# EAGLE design InvertingMixer (EAGLE 6.6.0)
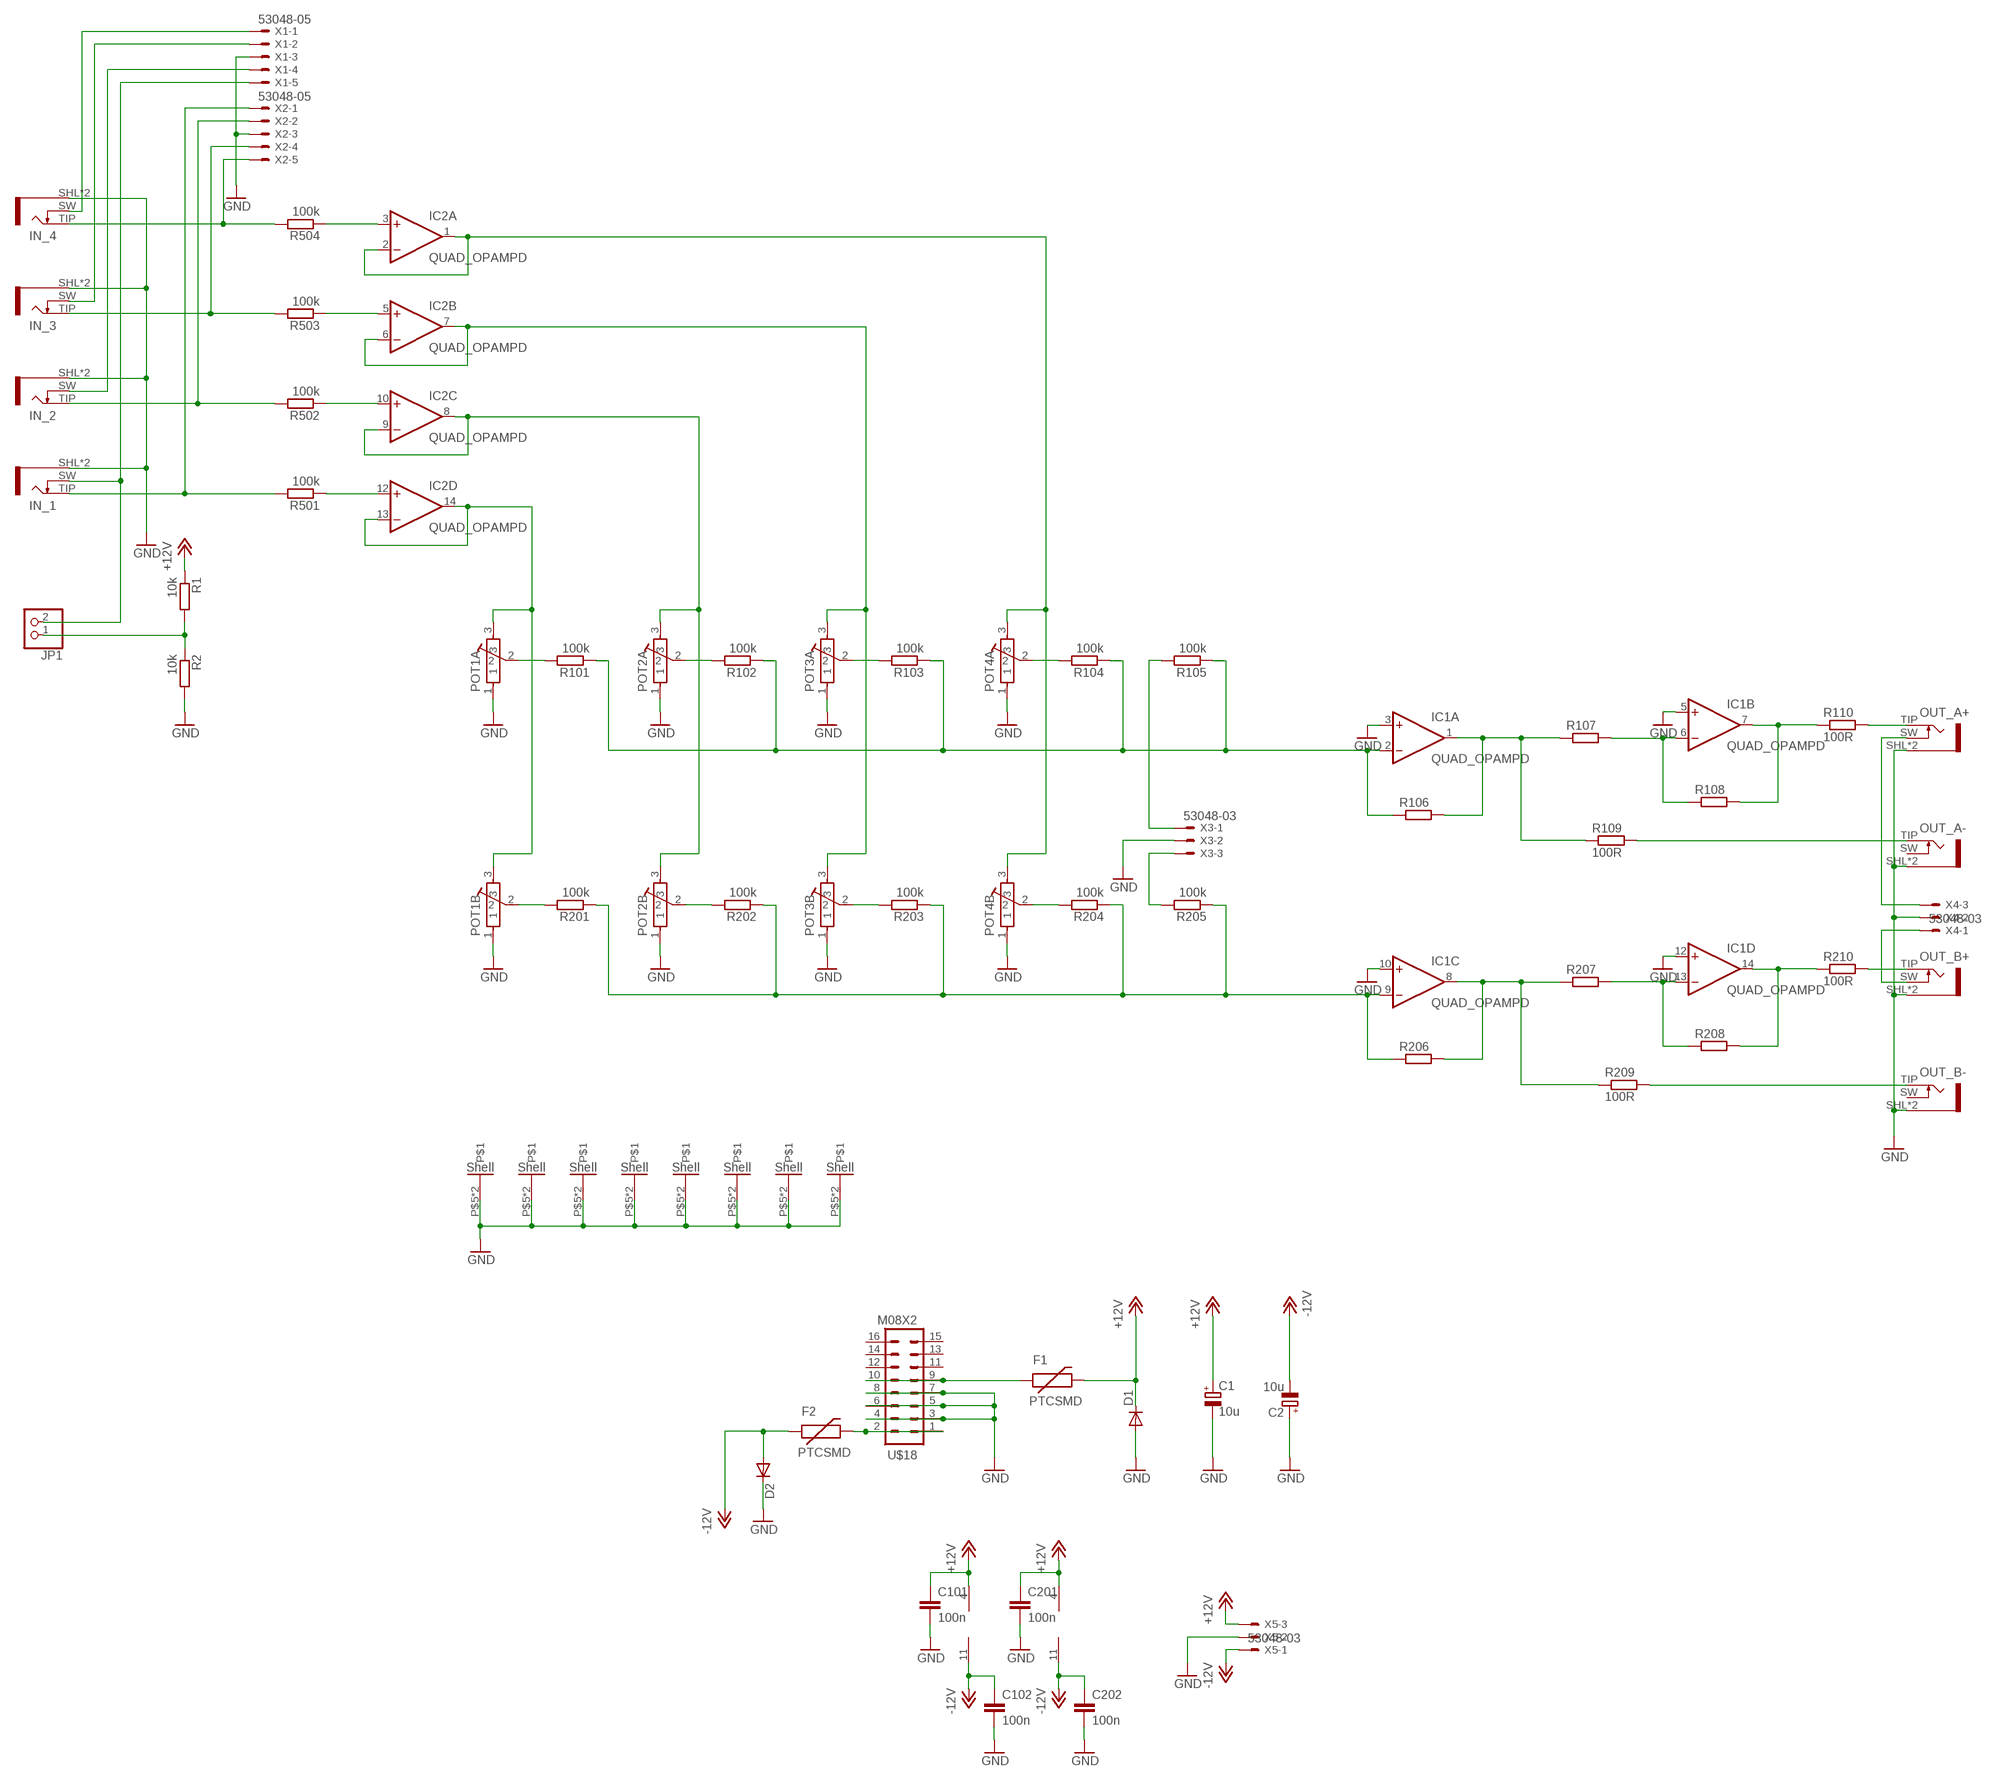
[diagram p0: schematic, sheet 1]

## Parts
C1  10u  CPOL-EUA  [PANASONIC_A]
C2  10u  CPOL-EUA  [PANASONIC_A]
C101  100n  C-EUC0603  [C0603]
C102  100n  C-EUC0603  [C0603]
C201  100n  C-EUC0603  [C0603]
C202  100n  C-EUC0603  [C0603]
D1  DIODESMA  [SMA-DIODE]
D2  DIODESMA  [SMA-DIODE]
F1  PTCSMD  [PTC-1206]
F2  PTCSMD  [PTC-1206]
IC1  QUAD_OPAMPD  [SO14]
IC2  QUAD_OPAMPD  [SO14]
IN_1  JACK-PJ-301B  [PJ-301B]
IN_2  JACK-PJ-301B  [PJ-301B]
IN_3  JACK-PJ-301B  [PJ-301B]
IN_4  JACK-PJ-301B  [PJ-301B]
JP1  PINHD-1X2  [1X02]
OUT_A+  JACK-PJ-301B  [PJ-301B]
OUT_A-  JACK-PJ-301B  [PJ-301B]
OUT_B+  JACK-PJ-301B  [PJ-301B]
OUT_B-  JACK-PJ-301B  [PJ-301B]
POT1A  POT-ALPS-RK09L1140  [POT-ALPS-RK09L1140]
POT1B  POT-ALPS-RK09L1140  [POT-ALPS-RK09L1140]
POT2A  POT-ALPS-RK09L1140  [POT-ALPS-RK09L1140]
POT2B  POT-ALPS-RK09L1140  [POT-ALPS-RK09L1140]
POT3A  POT-ALPS-RK09L1140  [POT-ALPS-RK09L1140]
POT3B  POT-ALPS-RK09L1140  [POT-ALPS-RK09L1140]
POT4A  POT-ALPS-RK09L1140  [POT-ALPS-RK09L1140]
POT4B  POT-ALPS-RK09L1140  [POT-ALPS-RK09L1140]
R1  10k  R-EU_R0603  [R0603]
R2  10k  R-EU_R0603  [R0603]
R101  100k  R-EU_R0603  [R0603]
R102  100k  R-EU_R0603  [R0603]
R103  100k  R-EU_R0603  [R0603]
R104  100k  R-EU_R0603  [R0603]
R105  100k  R-EU_R0603  [R0603]
R106  R-EU_R0603  [R0603]
R107  R-EU_R0603  [R0603]
R108  R-EU_R0603  [R0603]
R109  100R  R-EU_R0603  [R0603]
R110  100R  R-EU_R0603  [R0603]
R201  100k  R-EU_R0603  [R0603]
R202  100k  R-EU_R0603  [R0603]
R203  100k  R-EU_R0603  [R0603]
R204  100k  R-EU_R0603  [R0603]
R205  100k  R-EU_R0603  [R0603]
R206  R-EU_R0603  [R0603]
R207  R-EU_R0603  [R0603]
R208  R-EU_R0603  [R0603]
R209  100R  R-EU_R0603  [R0603]
R210  100R  R-EU_R0603  [R0603]
R501  100k  R-EU_R0603  [R0603]
R502  100k  R-EU_R0603  [R0603]
R503  100k  R-EU_R0603  [R0603]
R504  100k  R-EU_R0603  [R0603]
U$18  M08X2  [2X8]
X1  53048-05  [53048-05]
X2  53048-05  [53048-05]
X3  53048-03  [53048-03]
X4  53048-03  [53048-03]
X5  53048-03  [53048-03]

## Nets
+12V: C1.+ C101.1 C201.1 D1.C F1.2 IC1.4(P:V+) IC2.4(P:V+) R1.1 X5.3
-12V: C2.- C102.1 C202.1 D2.A F2.1 IC1.11(P:V-) IC2.11(P:V-) X5.1
GND: C1.- C2.+ C101.2 C102.2 C201.2 C202.2 D1.A D2.C IC1.3(A:+IN) IC1.5(B:+IN) IC1.10(C:+IN) IC1.12(D:+IN) IN_1.SHL(SLEEVE) IN_1.SLV(SLEEVE) IN_2.SHL(SLEEVE) IN_2.SLV(SLEEVE) IN_3.SHL(SLEEVE) IN_3.SLV(SLEEVE) IN_4.SHL(SLEEVE) IN_4.SLV(SLEEVE) OUT_A+.SHL(SLEEVE) OUT_A+.SLV(SLEEVE) OUT_A-.SHL(SLEEVE) OUT_A-.SLV(SLEEVE) OUT_B+.SHL(SLEEVE) OUT_B+.SLV(SLEEVE) OUT_B-.SHL(SLEEVE) OUT_B-.SLV(SLEEVE) POT1A.1 POT1A.P$5 POT1A.P$6 POT1B.1 POT1B.P$5 POT1B.P$6 POT2A.1 POT2A.P$5 POT2A.P$6 POT2B.1 POT2B.P$5 POT2B.P$6 POT3A.1 POT3A.P$5 POT3A.P$6 POT3B.1 POT3B.P$5 POT3B.P$6 POT4A.1 POT4A.P$5 POT4A.P$6 POT4B.1 POT4B.P$5 POT4B.P$6 R2.2 U$18.3 U$18.4 U$18.5 U$18.6 U$18.7 U$18.8 X1.3 X2.3 X3.2 X4.2 X5.2
N$1: IC1.1(A:OUT) R106.2 R107.1 R109.1
N$2: R205.2 X3.3
N$3: OUT_A+.SW X4.3
N$4: OUT_B+.SW X4.1
N$5: IC1.14(D:OUT) R208.2 R210.1
N$6: IC1.7(B:OUT) R108.2 R110.1
N$7: JP1.1 R1.2 R2.1
N$9: OUT_A+.TIP R110.2
N$11: OUT_A-.TIP R109.2
N$14: IC1.8(C:OUT) R206.2 R207.1 R209.1
N$15: OUT_B+.TIP R210.2
N$17: OUT_B-.TIP R209.2
N$18: IC1.6(B:-IN) R107.2 R108.1
N$20: POT1B.2 R201.2
N$23: IC1.13(D:-IN) R207.2 R208.1
N$27: IC2.8(C:OUT) IC2.9(C:-IN) POT2A.3 POT2B.3
N$29: POT1A.2 R101.2
N$30: POT2B.2 R202.2
N$31: POT3B.2 R203.2
N$33: IN_1.TIP R501.2 X2.1
N$34: IC2.13(D:-IN) IC2.14(D:OUT) POT1A.3 POT1B.3
N$35: IN_4.TIP R504.2 X2.5
N$36: IN_3.TIP R503.2 X2.4
N$37: IN_2.TIP R502.2 X2.2
N$38: IN_4.SW X1.1
N$39: IN_3.SW X1.2
N$40: IN_2.SW X1.4
N$41: IN_1.SW JP1.2 X1.5
N$42: IC2.3(A:+IN) R504.1
N$43: IC2.5(B:+IN) R503.1
N$44: POT4B.2 R204.2
N$47: POT4A.2 R104.2
N$48: IC2.10(C:+IN) R502.1
N$49: POT3A.2 R103.2
N$50: IC2.12(D:+IN) R501.1
N$51: POT2A.2 R102.2
N$52: IC1.2(A:-IN) R101.1 R102.1 R103.1 R104.1 R105.1 R106.1
N$53: IC2.6(B:-IN) IC2.7(B:OUT) POT3A.3 POT3B.3
N$56: F1.1 U$18.9 U$18.10
N$57: F2.2 U$18.1 U$18.2
N$58: IC2.1(A:OUT) IC2.2(A:-IN) POT4A.3 POT4B.3
N$61: IC1.9(C:-IN) R201.1 R202.1 R203.1 R204.1 R205.1 R206.1
N$63: R105.2 X3.1
Unconnected: OUT_A-.SW OUT_B-.SW U$18.11 U$18.12 U$18.13 U$18.14 U$18.15 U$18.16

## Library data of the parts
C1 C2 = resistor:CPOL-EU: POLARIZED CAPACITOR, European symbol
C101 C102 C201 C202 = resistor:C-EU: CAPACITOR, European symbol
D1 D2 = SparkFun:DIODE: Diode These are standard reverse protection diodes and small signal diodes. SMA package can handle up to about 1A. SOD-323 can handle about 200mA. What the SOD-323 package when ordering, there are some mfgs out there that are 5-pin packages.
F1 F2 = SparkFun:PTC: Resettable Fuse PTC Resettable Fuse. Spark Fun Electronics SKU : COM-08357
IC1 IC2 = adafruit:QUAD_OPAMP: OP AMP Standard quad package
IN_1-IN_4 OUT_A+ OUT_A- OUT_B+ OUT_B- = Rebel:JACK-PJ-301B
JP1 = pinhead:PINHD-1X2: PIN HEADER
POT1A POT1B POT2A POT2B POT3A POT3B POT4A POT4B = Rebel:POT-ALPS-RK09L
R1 R2 R101-R110 R201-R210 R501-R504 = resistor:R-EU_: RESISTOR, European symbol
U$18 = SparkFun:M08X2
X1 X2 = con-molex:53?-05: CONNECTOR wire to board 1.25 mm (.049 inch) pitch header; MF: MOLEX; MPN: 53048-0510; OC_FARNELL: 9732926; OC_NEWARK: 57H4722
X3-X5 = con-molex:53?-03: CONNECTOR wire to board 1.25 mm (.049 inch) pitch header; MF: WALDOM/MOLEX; MPN: 53048-0310; OC_FARNELL: 9732918; OC_NEWARK: 38C9908

## Board
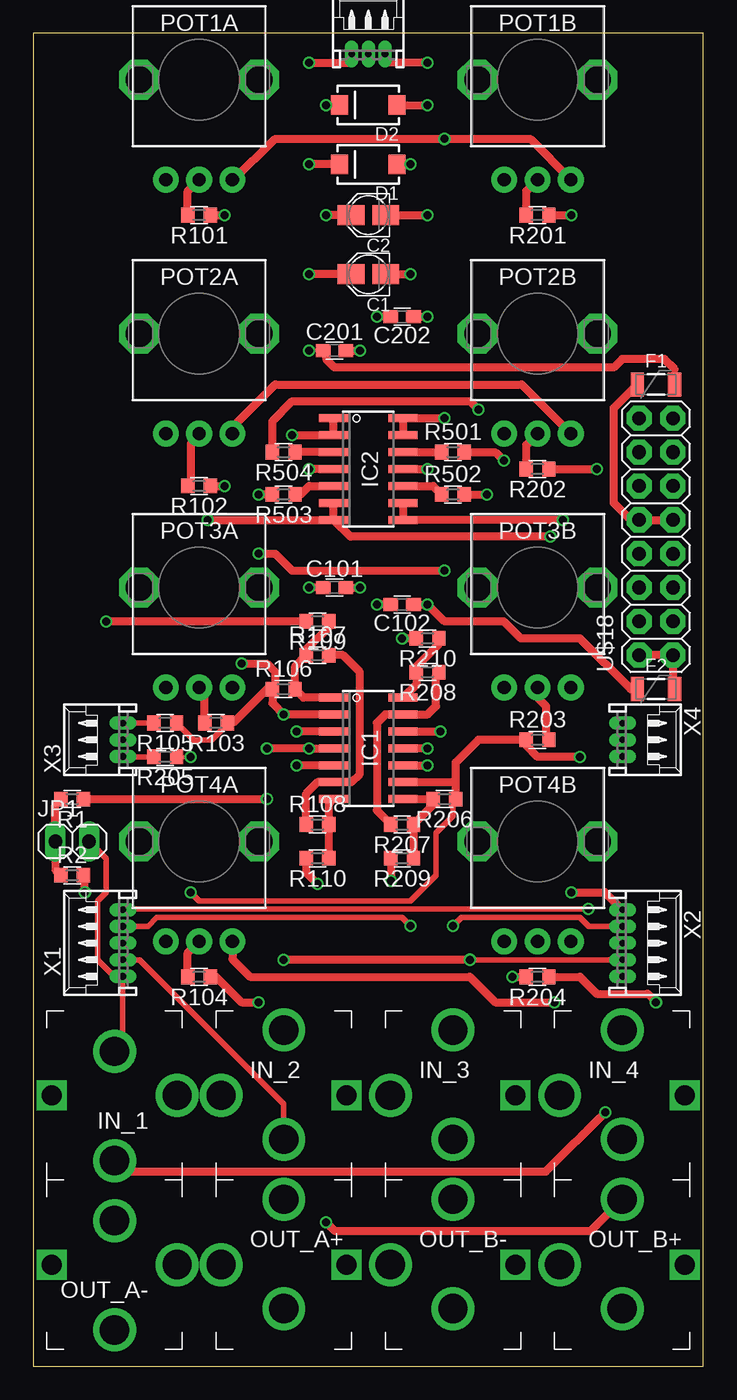
[diagram p1: board, top side]
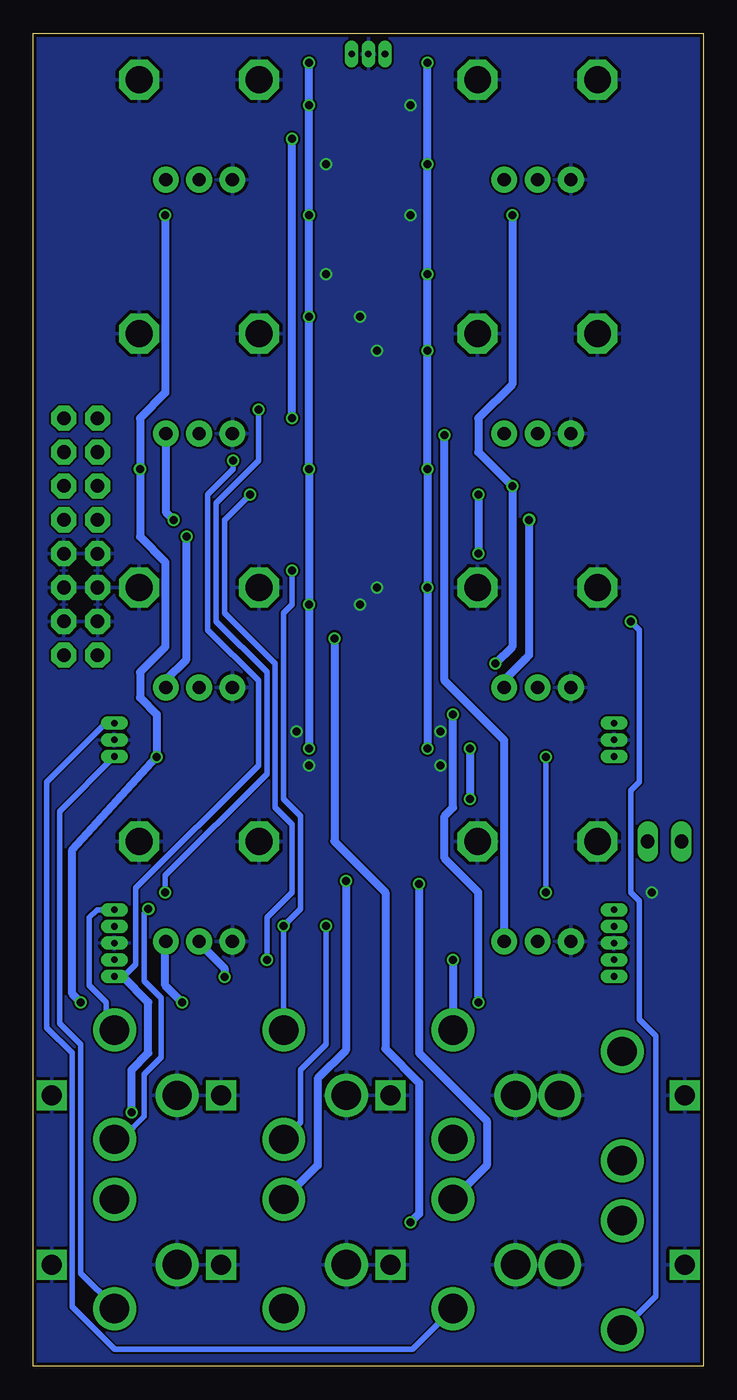
[diagram p2: board, bottom side, seen from below]

Size 50.29 x 100 mm. Coordinates in mm from the lower left corner, seen from the top.
Outline: 50.29,0 50.29,100 0,100 0,0 50.29,0
Copper layers (1*16): Top 0.035mm / dielectric 1.5mm / Bottom 0.035mm
Design rules "Fusion_eagle_rule_v1.1": minimum track width 6mil, minimum drill 12mil, track to track 6mil, track to pad 6mil, pad to pad 6mil, via to via 6mil, smd to smd 0mil, copper to edge 10mil, drill to drill 10mil, minimum pad ring 10mil, minimum via ring 6mil, stop-mask expansion 2mil, vias tented up to drill 100mil, thermal gap 10mil

### Footprints (pad centres in the part's own frame; a part is rotated, then mirrored left to right if it is on the bottom)
PANASONIC_A = smd 2 x 1.5: + 1.3,0; - -1.3,0
C0603 = smd 1.1 x 1: 1 -0.85,0; 2 0.85,0
SMA-DIODE = smd 1.27 x 1.47: A -2.15,0; C 2.15,0
PTC-1206 = smd 1 x 1.8: 1 -1.4,0; 2 1.4,0
SO14 = smd 0.6 x 2.2: 1 -3.81,-2.6; 2 -2.54,-2.6; 3 -1.27,-2.6; 4 0,-2.6; 5 1.27,-2.6; 6 2.54,-2.6; 7 3.81,-2.6; 8 3.81,2.6; 9 2.54,2.6; 10 1.27,2.6; 11 0,2.6; 12 -1.27,2.6; 13 -2.54,2.6; 14 -3.81,2.6
PJ-301B = drill 1.5 square: SHL 4.7,0 | drill 2.2: SLV -4.7,0; SW 0,-3.3; TIP 0,4.9
1X02 = drill 1.016 long: 1 -1.27,0; 2 1.27,0
POT-ALPS-RK09L1140 = drill 1 pad 1.93: 1 -2.5,-7.5; 2 0,-7.5; 3 2.5,-7.5 | drill 2 octagon: P$5 -4.5,0; P$6 4.5,0
R0603 = smd 1 x 1.1: 1 -0.85,0; 2 0.85,0
2X8 = drill 1.016 pad 1.88 octagon: 1 0,0; 2 0,2.54; 3 2.54,0; 4 2.54,2.54; 5 5.08,0; 6 5.08,2.54; 7 7.62,0; 8 7.62,2.54; 9 10.16,0; 10 10.16,2.54; 11 12.7,0; 12 12.7,2.54; 13 15.24,0; 14 15.24,2.54; 15 17.78,0; 16 17.78,2.54
53048-05 = drill 0.5 pad 0.698 long: 1 2.5,-1.25; 2 1.25,-1.25; 3 0,-1.25; 4 -1.25,-1.25; 5 -2.5,-1.25
53048-03 = drill 0.5 pad 0.698 long: 1 1.25,-1.25; 2 0,-1.25; 3 -1.25,-1.25

### Placement (x,y rotation side)
C1  25.15,81.92 180 top
C2  25.15,86.36 180 top
C101  22.61,58.42 0 top
C102  27.69,57.15 180 top
C201  22.61,76.2 0 top
C202  27.69,78.74 180 top
D1  25.15,90.17 180 top
D2  25.15,94.61 180 top
F1  46.74,73.66 0 top
F2  46.74,50.8 0 top
IC1  25.15,46.35 270 top
IC2  25.15,67.31 270 top
IN_1  6.1,20.32 180 top
IN_2  18.8,20.32 0 top
IN_3  31.5,20.32 0 top
IN_4  44.2,20.32 0 top
JP1  2.92,39.37 0 top
OUT_A+  18.8,7.62 0 top
OUT_A-  6.1,7.62 180 top
OUT_B+  44.2,7.62 0 top
OUT_B-  31.5,7.62 0 top
POT1A  12.45,96.52 0 top
POT1B  37.85,96.52 0 top
POT2A  12.45,77.47 0 top
POT2B  37.85,77.47 0 top
POT3A  12.45,58.42 0 top
POT3B  37.85,58.42 0 top
POT4A  12.45,39.37 0 top
POT4B  37.85,39.37 0 top
R1  2.92,42.55 180 top
R2  2.92,36.83 0 top
R101  12.45,86.36 180 top
R102  12.45,66.04 180 top
R103  13.72,48.26 180 top
R104  12.45,29.21 180 top
R105  9.91,48.26 180 top
R106  18.8,50.8 0 top
R107  21.34,53.34 0 top
R108  21.34,40.64 0 top
R109  21.34,55.88 180 top
R110  21.34,38.1 180 top
R201  37.85,86.36 180 top
R202  37.85,67.31 180 top
R203  37.85,46.99 0 top
R204  37.85,29.21 180 top
R205  9.91,45.72 180 top
R206  30.86,42.55 180 top
R207  27.69,40.64 180 top
R208  29.59,52.07 180 top
R209  27.69,38.1 180 top
R210  29.59,54.61 180 top
R501  31.5,68.58 0 top
R502  31.5,65.41 0 top
R503  18.8,65.41 180 top
R504  18.8,68.58 180 top
U$18  48.01,53.34 90 top
X1  5.46,31.75 90 top
X2  45.47,31.75 270 top
X3  5.46,46.99 90 top
X4  45.47,46.99 270 top
X5  25.15,99.69 0 top

### Tracks (layer width: path | path; a pad name or v marks a point on that pad's centre or on a via)
+12V  (via drill 0.6)
  Top 0.305: v20.7,76.2 C201.1 21.97,75.98 21.97,75.56 | F1.2 48.14,74.8 | 23.88,97.79 X5.3
  Top 0.61: IC1.4 v20.7,46.35 v17.53,46.35 | C101.1 v20.7,58.42 | IC2.4 v20.7,67.31 | C1.+ v20.7,81.92 | D1.C v20.7,90.17 | R1.1 v17.53,42.55 | 48.14,74.8 47.37,75.56 44.2,75.56 43.56,74.93 22.61,74.93 21.97,75.56 | v20.7,97.79 23.88,97.79
  Bottom 0.61: v20.7,46.35 v20.7,58.42 v20.7,67.31 v20.7,76.2 v20.7,81.92 v20.7,90.17 v20.7,97.79 | v17.53,46.35 v17.53,42.55
-12V  (via drill 0.6)
  Top 0.305: F2.1 44.83,50.8 | 26.42,97.79 X5.1
  Top 0.61: v29.59,46.35 IC1.11 | C102.1 v29.59,57.15 30.86,55.88 35.31,55.88 36.58,54.61 41.02,54.61 44.83,50.8 | IC2.11 v29.59,67.31 | C202.1 v29.59,78.74 | C2.- v29.59,86.36 | D2.A v29.59,94.61 | v29.59,97.79 26.42,97.79
  Bottom 0.61: v29.59,46.35 v29.59,57.15 v29.59,67.31 v29.59,78.74 v29.59,86.36 v29.59,94.61 v29.59,97.79
GND  (via drill 0.6)
  Top 0.61: C101.2 v24.51,58.42 | C102.2 v25.78,57.15 | C202.2 v25.78,78.74 | C201.2 v24.51,76.2 | C2.+ v21.97,86.36 | C1.- v28.32,81.92 | D1.A v28.32,90.17 | D2.C v21.97,94.61 | R2.2 v3.87,35.56 | IC1.12 v30.54,47.62 | IC1.3 v19.75,47.62 | IC1.5 v19.75,45.09 | IC1.10 v29.59,45.09
  pour Bottom: -10.41,0 56.9,0 56.9,100.33 -10.41,100.33
N$1
  Top 0.305: R107.1 20.49,53.76 | R109.1 22.19,55.46
  Top 0.61: IC1.1 20.28,50.16 R106.2 19.65,52.5 R107.1 | 22.19,55.46 20.49,53.76
N$2
  Top 0.305: 6.73,45.72 X3.3
  Top 0.406: R205.2 6.73,45.72
N$3
  Bottom 0.406: OUT_A+.SW 21.85,1.27 44.2,1.27 47.37,4.45 47.37,23.5 49.28,25.4 49.28,43.81 44.85,48.24 X4.3
N$4
  Bottom 0.305: OUT_B+.SW 44.2,4.45
  Bottom 0.406: 44.2,4.45 46.74,6.99 46.74,24.13 48.32,25.72 48.32,41.63 X4.1
N$5
  Top 0.305: R208.2 28.74,52.49 | R210.1 30.44,54.19
  Top 0.61: R208.2 28.74,51.16 IC1.14 | 30.44,54.19 28.74,52.49
N$6
  Top 0.61: R110.1 R108.2 22.19,42.19 IC1.7
N$7
  Top 0.61: R1.2 1.65,42.12 JP1.1 1.65,37.25 R2.1
N$9  (via drill 0.6)
  Top 0.61: R110.2 20.49,37.05 v21.34,36.2
  Bottom 0.61: v21.34,36.2 21.34,23.5 16.26,18.41 16.26,15.06 OUT_A+.TIP
N$11  (via drill 0.6)
  Top 0.61: R109.2 v5.46,55.88
  Bottom 0.406: v5.46,55.88 4.83,55.24 4.83,43.81 5.46,43.18 5.46,35.56 4.83,34.92 4.83,26.04 3.56,24.77 3.56,5.26 OUT_A-.TIP
N$14
  Top 0.305: R206.2 30.01,42.12
  Top 0.61: IC1.8 R206.2 | 30.01,42.12 R207.1 R209.1
N$15  (via drill 0.6)
  Top 0.61: R210.2 v27.69,54.61 | v21.97,10.79 22.61,10.16 41.84,10.16 OUT_B+.TIP
  Bottom 0.61: v27.69,54.61 27.69,39.37 23.88,35.56 23.88,23.81 21.34,21.27 21.34,11.43 v21.97,10.79
N$17  (via drill 0.6)
  Top 0.61: R209.2 v26.84,36.41
  Bottom 0.61: v26.84,36.41 26.84,23.71 28.96,21.59 28.96,15.06 OUT_B-.TIP
N$18
  Top 0.61: R108.1 20.49,42.97 21.34,43.81 IC1.6 23.88,43.81 24.51,44.45 24.51,52.07 23.24,53.34 R107.2
N$20
  Top 0.61: R201.2 37,88.17 POT1B.2
N$23
  Top 0.305: 30.23,51.85 R208.1
  Top 0.61: 30.23,51.85 30.23,49.53 29.59,48.9 IC1.13 26.42,48.9 25.78,48.26 25.78,41.7 R207.2
N$27  (via drill 0.6)
  Top 0.61: IC2.9 IC2.8 v39.75,63.5 | POT2A.3 14.95,70.44 18.16,73.66 36.66,73.66 POT2B.3
  Bottom 0.61: POT2B.3 40.35,64.09 v39.75,63.5
N$29
  Top 0.61: R101.2 11.6,88.17 POT1A.2
N$30
  Top 0.61: R202.2 37,69.12 POT2B.2
N$31
  Top 0.305: 38.48,47.2 R203.2
  Top 0.61: POT3B.2 37.85,50.16 38.48,49.53 38.48,47.2
N$33  (via drill 0.6)
  Top 0.61: IN_1.TIP 6.1,15.24 6.73,14.61 38.48,14.61 v42.93,19.05 | R501.2 34.67,68.58 v35.31,67.94
  Bottom 0.305: 44.18,29.21 X2.1
  Bottom 0.406: v35.31,67.94 35.31,67.31 37.21,65.41 37.21,55.24 33.4,51.44 33.4,45.09 42.61,35.88 42.61,30.16 43.56,29.21 44.18,29.21
  Bottom 0.61: v42.93,19.05 42.93,22.23 41.66,23.5 41.66,27.3 43.56,29.21
N$34  (via drill 0.6)
  Top 0.305: POT1A.3 14.95,88.94
  Top 0.61: IC2.13 IC2.14 v30.86,71.12 | 14.95,88.94 18.16,92.08 v30.86,92.08 37.29,92.08 POT1B.3
  Bottom 0.61: v30.86,71.12 v30.86,92.08
N$35  (via drill 0.6)
  Top 0.61: R504.2 17.95,70.91 19.43,72.39 32.77,72.39 v33.4,71.75 | v40.39,35.56 42.91,35.56 X2.5
  Bottom 0.406: v33.4,71.75 33.4,67.94 36.58,64.77 36.58,55.88 32.77,52.07 32.77,44.45 40.39,36.83 v40.39,35.56 | X2.5 45.51,34.25 46.1,33.66 46.1,28.57 44.83,27.3 44.83,25.86 IN_4.TIP
N$36  (via drill 0.6)
  Top 0.406: X2.4 41.68,33 41.02,33.66 32.13,33.66 v31.5,33.02
  Top 0.61: R503.2 v16.89,65.41 | v16.89,60.96 18.16,60.96 19.43,59.69 v30.86,59.69
  Bottom 0.406: IN_3.TIP v31.5,33.02 30.23,34.29 30.23,41.27 31.5,42.55 31.5,56.52 30.86,57.15 v30.86,59.69
  Bottom 0.61: v16.89,65.41 v16.89,60.96
N$37  (via drill 0.6)
  Top 0.305: 18.82,30.5 v18.8,30.48
  Top 0.406: X2.2 v32.77,30.5
  Top 0.61: v32.77,30.5 18.82,30.5 | R502.2 v34.04,65.41
  Bottom 0.406: v34.04,65.41 35.94,63.5 35.94,56.52 32.13,52.7 32.13,41.91 30.86,40.64 30.86,35.56 32.77,33.66 v32.77,30.5
  Bottom 0.61: v18.8,30.48 IN_2.TIP
N$38  (via drill 0.6)
  Top 0.305: X1.1 6.75,34.29
  Top 0.406: v41.66,34.29 6.75,34.29
  Bottom 0.406: v41.66,34.29 41.97,33.97 41.97,28.89 40.7,27.62 40.7,23.18 41.97,21.91 41.97,18.73 43.56,17.14 44.07,17.14 IN_4.SW
N$39  (via drill 0.6)
  Top 0.406: X1.2 8.62,33 9.27,33.66 27.69,33.66 v28.32,33.02
  Bottom 0.406: v28.32,33.02 28.32,24.13 30.23,22.23 30.23,18.29 IN_3.SW
N$40
  Top 0.406: X1.4 7.98,30.5 18.8,19.68 IN_2.SW
N$41
  Top 0.406: IN_1.SW 6.71,24.23 X1.5 6.67,29.21 6.1,29.21 4.83,30.48 4.83,34.92 5.46,35.56 5.46,38.1 JP1.2
N$42
  Top 0.61: IC2.3 R504.1
N$43
  Top 0.305: R503.1 20.07,65.41
  Top 0.61: 20.07,65.41 20.7,66.04 IC2.5
N$44  (via drill 0.6)
  Top 0.61: v35.94,29.21 R204.2
  Bottom 0.305: POT4B.2 37.85,31.75
  Bottom 0.61: 37.85,31.75 35.94,29.84 v35.94,29.21
N$47
  Top 0.61: R104.2 11.6,31.02 POT4A.2
N$48
  Top 0.61: IC2.10 30.01,66.04 R502.1
N$49
  Top 0.61: R103.2 12.87,50.5 POT3A.2
N$50
  Top 0.61: IC2.12 R501.1
N$51
  Top 0.305: 11.81,66.25 R102.2
  Top 0.61: POT2A.2 12.45,69.85 11.81,69.22 11.81,66.25
N$52  (via drill 0.6)
  Top 0.305: 14.99,48.26 14.67,48.26 R103.1 | R104.1 13.72,29.21 | 18.16,51.02 R106.1
  Top 0.406: 14.67,48.26 13.4,46.99 12.03,46.99 R105.1
  Top 0.61: IC1.2 v18.8,48.9 17.95,49.74 R106.1 17.53,50.8 14.99,48.26 | 13.72,29.21 15.62,27.3 v16.89,27.3 | R102.1 v14.35,66.04 | v15.62,52.7 17.53,52.7 18.16,52.07 18.16,51.02 | R101.1 v14.35,86.36
  Bottom 0.61: v16.89,27.3 16.89,35.56 19.43,38.1 19.43,41.27 18.8,41.91 v18.8,48.9 | v15.62,52.7 14.35,53.98 v14.35,66.04 16.89,68.58 16.89,71.12 14.35,73.66 v14.35,86.36
N$53  (via drill 0.6)
  Top 0.61: IC2.7 IC2.6 | v13.08,63.5 IC2.7 | v38.8,62.23 23.82,62.23 IC2.7
  Bottom 0.61: POT3A.3 14.95,51.48 13.4,53.02 13.08,53.34 v13.08,63.5 | POT3B.3 40.35,51.48 38.8,53.02 v38.8,62.23
N$56
  Top 0.61: U$18.9 U$18.10 44.83,63.5 43.56,64.77 43.56,71.89 F1.1
N$57
  Top 0.61: U$18.2 U$18.1 48.01,50.93 F2.2
N$58  (via drill 0.6)
  Top 0.61: IC2.1 IC2.2 v19.43,69.85 | POT4A.3 14.95,30.52 16.26,29.21 32.77,29.21 34.67,27.3 v39.12,27.3
  Bottom 0.61: v39.12,27.3 40.39,28.57 40.39,31.2 POT4B.3 | POT4A.3 14.95,46.95 19.43,51.44 v19.43,69.85
N$61  (via drill 0.6)
  Top 0.305: R205.1 v11.81,45.72 | 31.5,42.33 R206.1
  Top 0.406: v11.81,35.56 12.45,34.92 28.32,34.92 30.23,36.83 30.23,40.01 31.5,41.27 31.5,42.33
  Top 0.61: IC1.9 31.71,43.81 | R206.1 31.71,43.81 | 31.71,43.81 31.71,45.3 33.4,46.99 R203.1 37,46.57 37.85,45.72 v41.02,45.72 | R201.1 v40.39,86.36 | R202.1 v42.29,67.31 | R204.1 41.02,29.21 42.29,27.94 46.1,27.94 v46.74,27.3
  Bottom 0.406: v11.81,45.72 v11.81,35.56
  Bottom 0.61: v40.39,86.36 40.39,73.03 42.29,71.12 v42.29,67.31 42.29,62.23 40.39,60.33 40.39,53.98 42.29,52.07 42.29,50.16 41.02,48.9 v41.02,45.72 47.37,38.73 47.37,27.94 v46.74,27.3
N$63
  Top 0.406: X3.1 7.77,48.24 R105.2